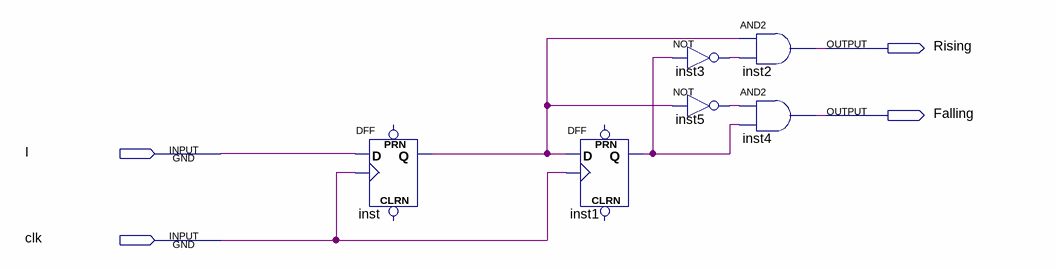
[diagram p0: schematic sheet]
// Quartus schematic EDGED.bdf as structural Verilog: 6 symbols, 4 pins
module EDGED (
  input  I,
  input  clk,
  output Rising,
  output Falling
);

  wire inst1_q, inst3_out, inst5_out, inst_q;

  DFF inst (.CLK(clk), .D(I), .Q(inst_q));  // open: CLRN, PRN
  DFF inst1 (.CLK(clk), .D(inst_q), .Q(inst1_q));  // open: CLRN, PRN
  and inst2 (Rising, inst_q, inst3_out);
  not inst3 (inst3_out, inst1_q);
  and inst4 (Falling, inst5_out, inst1_q);
  not inst5 (inst5_out, inst_q);
endmodule
